# EAGLE schematic SimpleIO (EAGLE 7.5.0)
USB HID IO Device Sample (c) 2017 VV-Soft Oy Apache License v2.0
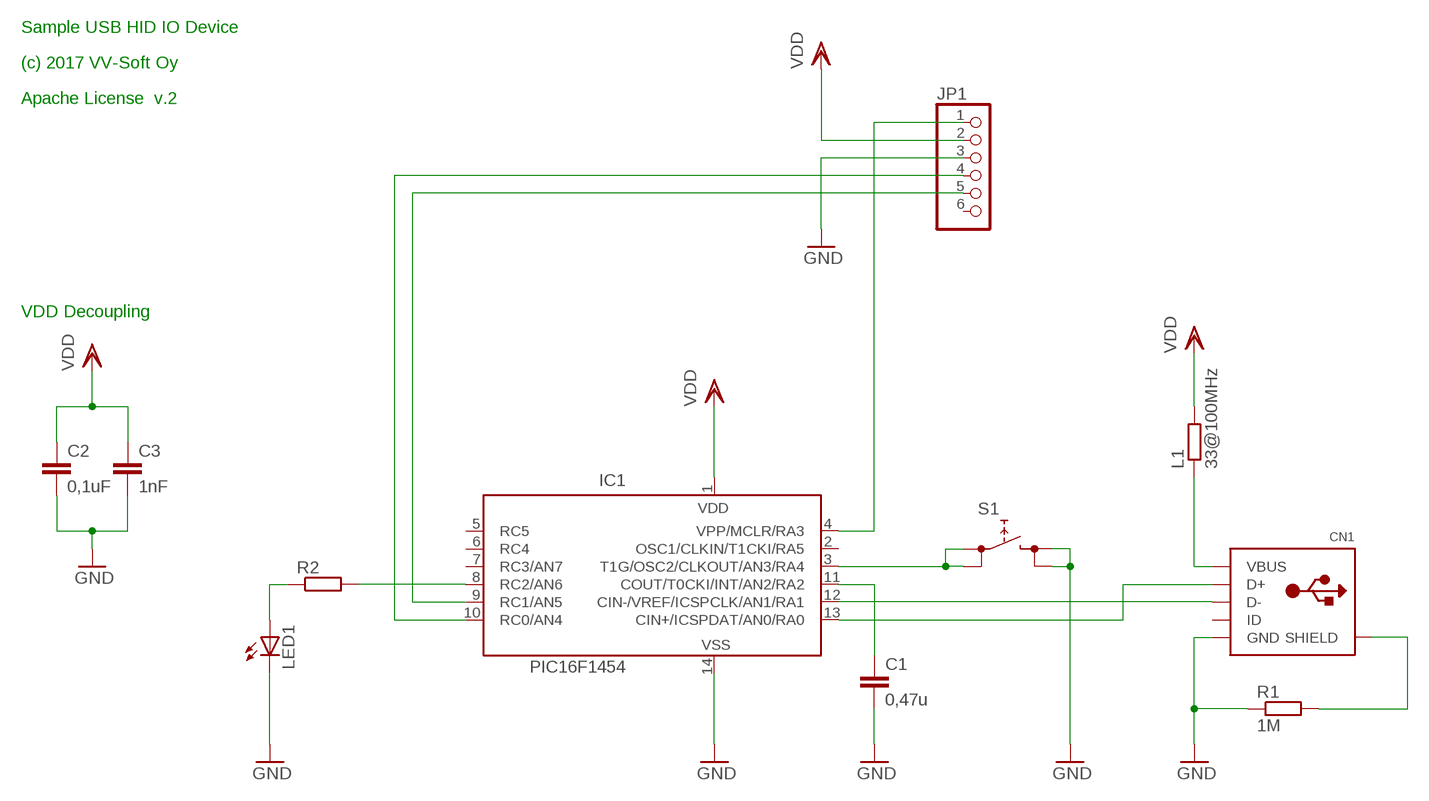
[diagram p0: schematic, sheet 1]

## Parts
C1  0,47u  C-EUC0603  [C0603]
C2  0,1uF  C-EUC0603  [C0603]
C3  1nF  C-EUC0603  [C0603]
CN1  USBMICROB  [USB-MICROB]
IC1  PIC16F1454  PIC16F1503SL  [SO-14]
JP1  PINHD-1X6  [1X06]
L1  33@100MHz  R-EU_R0603  [R0603]
LED1  LED  [SMARTLED-TTW]
R1  1M  R-EU_R0603  [R0603]
R2  R-EU_R0603  [R0603]
S1  REKN  [REKN]

## Nets
GND: C1.2 C2.2 C3.2 CN1.P5(GND) IC1.14(VSS) JP1.3 LED1.C@1(C) R1.1 S1.1A S1.1B
N$1: CN1.P1(VBUS) L1.1
N$2: CN1.PAD-LB(SHIELD) CN1.PAD-LLB(SHIELD) CN1.PAD-LT(SHIELD) CN1.PAD-RB(SHIELD) CN1.PAD-RRB(SHIELD) CN1.PAD-RT(SHIELD) R1.2
N$3: CN1.P3(D+) IC1.13(CIN+/ICSPDAT/AN0/RA0)
N$4: CN1.P2(D-) IC1.12(CIN-/VREF/ICSPCLK/AN1/RA1)
N$5: C1.1 IC1.11(COUT/T0CKI/INT/AN2/RA2)
N$6: IC1.3(T1G/OSC2/CLKOUT/AN3/RA4) S1.0A S1.0B
N$7: IC1.8(RC2/AN6) R2.2
N$8: IC1.4(VPP/MCLR/RA3) JP1.1
N$9: IC1.10(RC0/AN4) JP1.4
N$10: IC1.9(RC1/AN5) JP1.5
N$11: LED1.A@1(A) R2.1
VDD: C2.1 C3.1 IC1.1(VDD) JP1.2 L1.2
Unconnected: CN1.P4(ID) IC1.2(OSC1/CLKIN/T1CKI/RA5) IC1.5(RC5) IC1.6(RC4) IC1.7(RC3/AN7) JP1.6

## Notes on the sheet
- Sample USB HID IO Device
- (c) 2017 VV-Soft Oy
- Apache License  v.2
- VDD Decoupling

## Library data of the parts
C1-C3 = rcl:C-EU: CAPACITOR, European symbol
CN1 = nonolith:USB: USB Connectors USBMINIB - Surface Mount Female Mini-B USB Connector 4UConnector: 06564 By microbuilder.eu
IC1 = FieldData:PIC16F1503: 14-Pin, Flash-Based 8-Bit CMOS Microcontroller High Performance RISC CPU: * Only 35 instructions to learn - All single-cycle instructions except branches * Operating speed: - DC - 20 MHz oscillator/clock input - DC - 200 ns instruction cycle * Internal and external oscillator options - Precision Internal 4 MHz oscillator factory calibrated to ±1% - External Oscillator support for crystals and resonators - 5?s wake-up from SLEEP, 3.0V, typical * Power saving SLEEP mode * Wide operating voltage range - 2.0V to 5.5V * Industrial and Extended temperature range * Low power Power-on Reset (POR) * Power-up Timer (PWRT) and Oscillator Start-up Timer (OST) * Brown-out Detect (BOD) * Watchdog Timer (WDT) with independent oscillator for reliable operation * Multiplexed MCLR/Input-pin * Interrupt-on-pin change * Individual programmable weak pull-ups * Programmable code protection * High Endurance FLASH/EEPROM Cell - 100,000 write FLASH endurance - 1,000,000 write EEPROM endurance - FLASH/Data EEPROM Retention: > 40 years * Standby Current: - 1 nA @ 2.0V, typical * Operating Current: - 8.5?A @ 32 kHz, 2.0V, typical - 100?A @ 1 MHz, 2.0V, typical * Watchdog Timer Current - 300 nA @ 2.0V, typical * Timer1 oscillator current: - 4?A @ 32 kHz, 2.0V, typical * 12 I/O pins with individual direction control * High current sink/source for direct LED drive * Analog-to-Digital Converter module (PIC16F676): - 10-bit resolution - Programmable 8-channel input - Voltage reference input * In-Circuit Serial ProgrammingTM (ICSPTM) via two pins Source: http://ww1.microchip.com/downloads/en/DeviceDoc/40039E.pdf
JP1 = pinhead:PINHD-1X6: PIN HEADER
L1 R1 R2 = rcl:R-EU_: RESISTOR, European symbol
LED1 = led:LED: LED OSRAM: - CHIPLED LG R971, LG N971, LY N971, LG Q971, LY Q971, LO R971, LY R971 LH N974, LH R974 LS Q976, LO Q976, LY Q976 LO Q996 - Hyper CHIPLED LW Q18S LB Q993, LB Q99A, LB R99A - SideLED LS A670, LO A670, LY A670, LG A670, LP A670 LB A673, LV A673, LT A673, LW A673 LH A674 LY A675 LS A676, LA A676, LO A676, LY A676, LW A676 LS A679, LY A679, LG A679 - Hyper Micro SIDELED® LS Y876, LA Y876, LO Y876, LY Y876 LT Y87S - SmartLED LW L88C, LW L88S LB L89C, LB L89S, LG L890 LS L89K, LO L89K, LY L89K LS L896, LA L896, LO L896, LY L896 - TOPLED LS T670, LO T670, LY T670, LG T670, LP T670 LSG T670, LSP T670, LSY T670, LOP T670, LYG T670 LG T671, LOG T671, LSG T671 LB T673, LV T673, LT T673, LW T673 LH T674 LS T676, LA T676, LO T676, LY T676, LB T676, LH T676, LSB T676, LW T676 LB T67C, LV T67C, LT T67C, LS T67K, LO T67K, LY T67K, LW E67C LS E67B, LA E67B, LO E67B, LY E67B, LB E67C, LV E67C, LT E67C LW T67C LS T679, LY T679, LG T679 LS T770, LO T770, LY T770, LG T770, LP T770 LB T773, LV T773, LT T773, LW T773 LH T774 LS E675, LA E675, LY E675, LS T675 LS T776, LA T776, LO T776, LY T776, LB T776 LHGB T686 LT T68C, LB T68C - Hyper Mini TOPLED® LB M676 - Mini TOPLED Santana® LG M470 LS M47K, LO M47K, LY M47K Source: http://www.osram.convergy.de LUXEON: - LUMILED® LXK2-PW12-R00, LXK2-PW12-S00, LXK2-PW14-U00, LXK2-PW14-V00 LXK2-PM12-R00, LXK2-PM12-S00, LXK2-PM14-U00 LXK2-PE12-Q00, LXK2-PE12-R00, LXK2-PE12-S00, LXK2-PE14-T00, LXK2-PE14-U00 LXK2-PB12-K00, LXK2-PB12-L00, LXK2-PB12-M00, LXK2-PB14-N00, LXK2-PB14-P00, LXK2-PB14-Q00 LXK2-PR12-L00, LXK2-PR12-M00, LXK2-PR14-Q00, LXK2-PR14-R00 LXK2-PD12-Q00, LXK2-PD12-R00, LXK2-PD12-S00 LXK2-PH12-R00, LXK2-PH12-S00 LXK2-PL12-P00, LXK2-PL12-Q00, LXK2-PL12-R00 Source: www.luxeon.com KINGBRIGHT: KA-3528ASYC Source: www.kingbright.com
S1 = switch:REKN: PUSH SWITCH ITT-Cannon-Cannon